# EAGLE schematic PCB-ACMb (EAGLE 6.4)
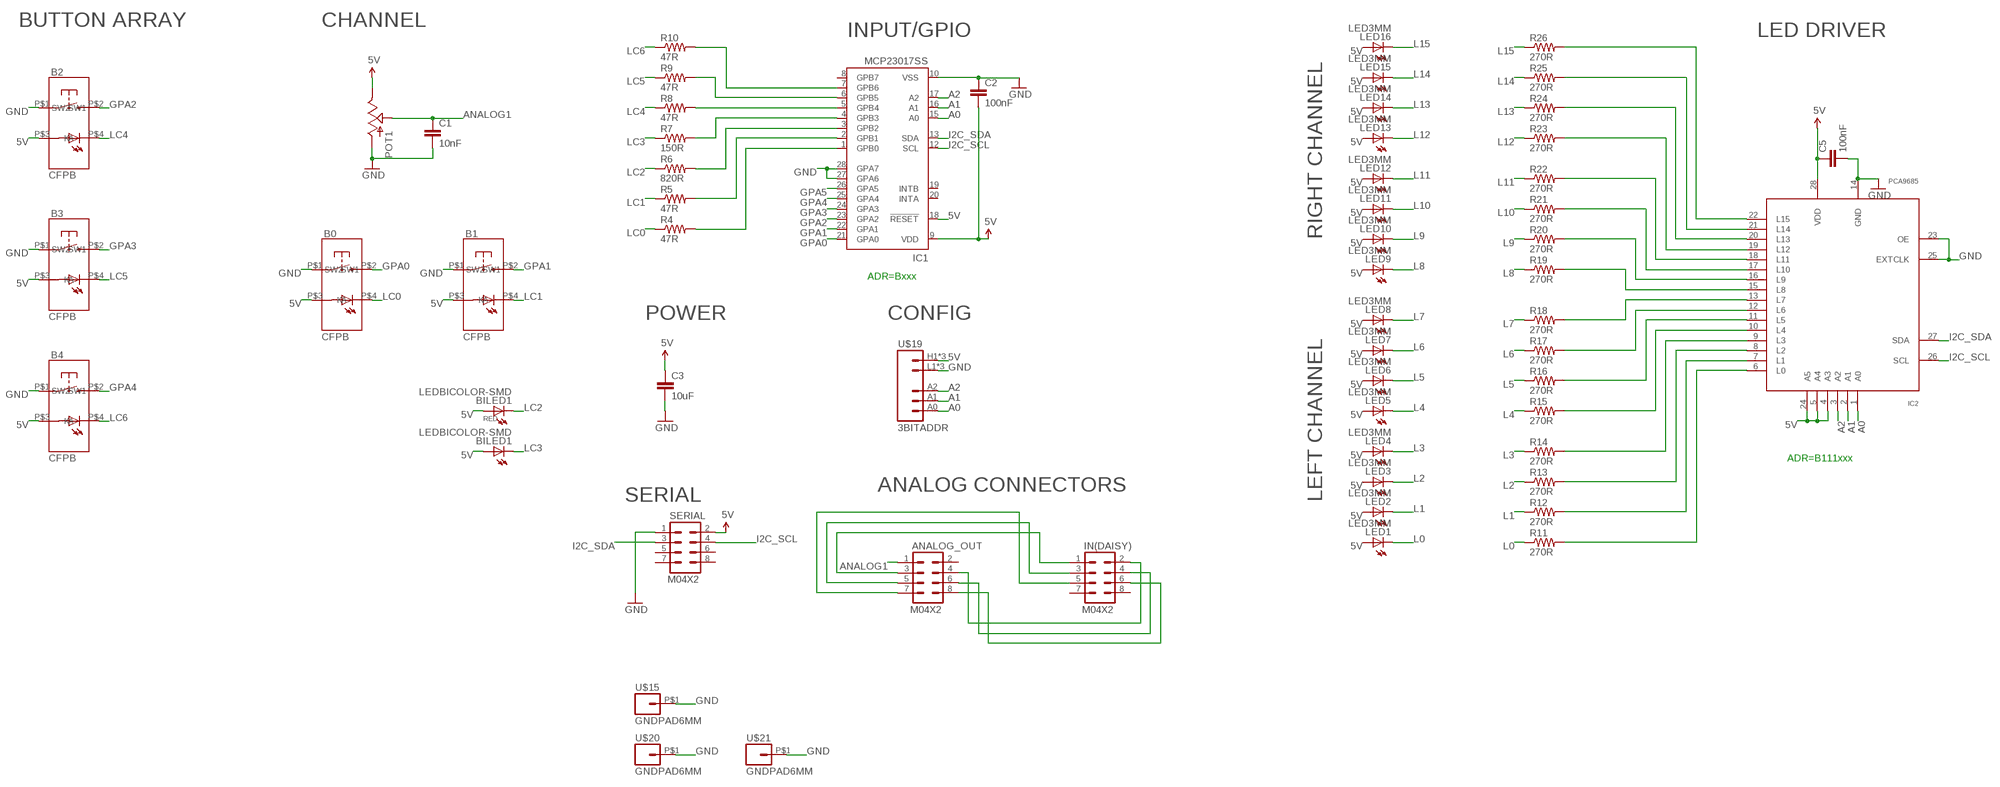
[diagram p0: schematic, sheet 1]

## Parts
ANALOG_OUT  M04X2  [2X4]
B0  CFPB  [CFPB-6/9MM]
B1  CFPB  [CFPB-6/9MM]
B2  CFPB  [CFPB-6/9MM]
B3  CFPB  [CFPB-6/9MM]
B4  CFPB  [CFPB-6/9MM]
BILED1  LEDBICOLOR-SMD  [LEDBICOLOR-SMD]
C1  10nF  CAP0603-CAP  [0603-CAP]
C2  100nF  CAP0603-CAP  [0603-CAP]
C3  10uF  CAP0805  [0805]
C5  100nF  CAP0603-CAP  [0603-CAP]
IC1  MCP23017SS  [SSOP28]
IC2  PCA9685  [TSSOP28]
IN(DAISY)  M04X2  [2X4]
LED1  LED3MM  [LED3MM]
LED2  LED3MM  [LED3MM]
LED3  LED3MM  [LED3MM]
LED4  LED3MM  [LED3MM]
LED5  LED3MM  [LED3MM]
LED6  LED3MM  [LED3MM]
LED7  LED3MM  [LED3MM]
LED8  LED3MM  [LED3MM]
LED9  LED3MM  [LED3MM]
LED10  LED3MM  [LED3MM]
LED11  LED3MM  [LED3MM]
LED12  LED3MM  [LED3MM]
LED13  LED3MM  [LED3MM]
LED14  LED3MM  [LED3MM]
LED15  LED3MM  [LED3MM]
LED16  LED3MM  [LED3MM]
POT1  POT  [ALPS_POT]
R4  47R  RESISTOR0603-RES  [0603-RES]
R5  47R  RESISTOR0603-RES  [0603-RES]
R6  820R  RESISTOR0603-RES  [0603-RES]
R7  150R  RESISTOR0603-RES  [0603-RES]
R8  47R  RESISTOR0603-RES  [0603-RES]
R9  47R  RESISTOR0603-RES  [0603-RES]
R10  47R  RESISTOR0603-RES  [0603-RES]
R11  270R  RESISTOR0603-RES  [0603-RES]
R12  270R  RESISTOR0603-RES  [0603-RES]
R13  270R  RESISTOR0603-RES  [0603-RES]
R14  270R  RESISTOR0603-RES  [0603-RES]
R15  270R  RESISTOR0603-RES  [0603-RES]
R16  270R  RESISTOR0603-RES  [0603-RES]
R17  270R  RESISTOR0603-RES  [0603-RES]
R18  270R  RESISTOR0603-RES  [0603-RES]
R19  270R  RESISTOR0603-RES  [0603-RES]
R20  270R  RESISTOR0603-RES  [0603-RES]
R21  270R  RESISTOR0603-RES  [0603-RES]
R22  270R  RESISTOR0603-RES  [0603-RES]
R23  270R  RESISTOR0603-RES  [0603-RES]
R24  270R  RESISTOR0603-RES  [0603-RES]
R25  270R  RESISTOR0603-RES  [0603-RES]
R26  270R  RESISTOR0603-RES  [0603-RES]
SERIAL  M04X2  [2X4]
U$15  GNDPAD6MM  [3.2MMPAD6MM]
U$19  3BITADDR  [3BITADDR]
U$20  GNDPAD6MM  [3.2MMPAD6MM]
U$21  GNDPAD6MM  [3.2MMPAD6MM]

## Nets
5V [Power]: B0.P$3(A) B1.P$3(A) B2.P$3(A) B3.P$3(A) B4.P$3(A) BILED1.P$1(A) BILED1.P$3(A1) C2.2 C3.1 C5.1 IC1.9(VDD) IC1.18(!RESET) IC2.4(A3) IC2.5(A4) IC2.24(A5) IC2.28(VDD) LED1.A LED2.A LED3.A LED4.A LED5.A LED6.A LED7.A LED8.A LED9.A LED10.A LED11.A LED12.A LED13.A LED14.A LED15.A LED16.A POT1.P$1(E) SERIAL.2 U$19.H1(VCC) U$19.H2(VCC) U$19.H3(VCC)
A0: IC1.15(A0) IC2.1(A0) U$19.A0
A1: IC1.16(A1) IC2.2(A1) U$19.A1
A2: IC1.17(A2) IC2.3(A2) U$19.A2
ANALOG1: ANALOG_OUT.1 C1.1 POT1.P$2(S)
GND [Power]: B0.P$1(SW1) B1.P$1(SW1) B2.P$1(SW1) B3.P$1(SW1) B4.P$1(SW1) C1.2 C2.1 C3.2 C5.2 IC1.10(VSS) IC1.27(GPA6) IC1.28(GPA7) IC2.14(GND) IC2.23(OE) IC2.25(EXTCLK) POT1.P$3(A) SERIAL.1 U$15.P$1 U$19.L1(GND) U$19.L2(GND) U$19.L3(GND) U$20.P$1 U$21.P$1
GPA0 [Signal]: B0.P$2(SW2) IC1.21(GPA0)
GPA1 [Signal]: B1.P$2(SW2) IC1.22(GPA1)
GPA2 [Signal]: B2.P$2(SW2) IC1.23(GPA2)
GPA3 [Signal]: B3.P$2(SW2) IC1.24(GPA3)
GPA4 [Signal]: B4.P$2(SW2) IC1.25(GPA4)
GPA5 [Signal]: IC1.26(GPA5)
I2C_SCL: IC1.12(SCL) IC2.26(SCL) SERIAL.4
I2C_SDA: IC1.13(SDA) IC2.27(SDA) SERIAL.3
L0: LED1.K(C) R11.1
L1: LED2.K(C) R12.1
L2: LED3.K(C) R13.1
L3: LED4.K(C) R14.1
L4: LED5.K(C) R15.1
L5: LED6.K(C) R16.1
L6: LED7.K(C) R17.1
L7: LED8.K(C) R18.1
L8: LED9.K(C) R19.1
L9: LED10.K(C) R20.1
L10: LED11.K(C) R21.1
L11: LED12.K(C) R22.1
L12: LED13.K(C) R23.1
L13: LED14.K(C) R24.1
L14: LED15.K(C) R25.1
L15: LED16.K(C) R26.1
LC0: B0.P$4(K) R4.1
LC1: B1.P$4(K) R5.1
LC2: BILED1.P$2(C) R6.1
LC3: BILED1.P$4(C1) R7.1
LC4: B2.P$4(K) R8.1
LC5: B3.P$4(K) R9.1
LC6: B4.P$4(K) R10.1
N$1: IC2.13(L7) R18.2
N$2: IC1.4(GPB3) R7.2
N$3: IC1.5(GPB4) R8.2
N$4: IC1.6(GPB5) R9.2
N$5: IC1.7(GPB6) R10.2
N$7: IC1.3(GPB2) R6.2
N$8: IC1.2(GPB1) R5.2
N$9: IC1.1(GPB0) R4.2
N$10: ANALOG_OUT.3 IN(DAISY).1
N$11: ANALOG_OUT.5 IN(DAISY).3
N$12: ANALOG_OUT.7 IN(DAISY).5
N$13: ANALOG_OUT.4 IN(DAISY).2
N$14: ANALOG_OUT.6 IN(DAISY).4
N$15: ANALOG_OUT.8 IN(DAISY).6
N$16: IC2.12(L6) R17.2
N$17: IC2.11(L5) R16.2
N$18: IC2.10(L4) R15.2
N$19: IC2.9(L3) R14.2
N$20: IC2.8(L2) R13.2
N$21: IC2.7(L1) R12.2
N$22: IC2.6(L0) R11.2
N$23: IC2.15(L8) R19.2
N$24: IC2.16(L9) R20.2
N$25: IC2.17(L10) R21.2
N$26: IC2.18(L11) R22.2
N$27: IC2.19(L12) R23.2
N$28: IC2.20(L13) R24.2
N$29: IC2.21(L14) R25.2
N$30: IC2.22(L15) R26.2
Unconnected: ANALOG_OUT.2 IC1.8(GPB7) IC1.19(INTB) IC1.20(INTA) IN(DAISY).7 IN(DAISY).8 SERIAL.5 SERIAL.6 SERIAL.7 SERIAL.8

## Notes on the sheet
- BUTTON ARRAY | CHANNEL
- INPUT/GPIO | LED DRIVER
- RIGHT CHANNEL
- ADR=Bxxx
- POWER | CONFIG
- ADR=B111xxx
- ANALOG CONNECTORS
- SERIAL | LEFT CHANNEL

## Library data of the parts
ANALOG_OUT IN(DAISY) SERIAL = SparkFun:M04X2
B0 B1-B4 = SKAARHOJ:CFPB
BILED1 = SKAARHOJ:LEDBICOLOR-SMD
C1-C3 C5 = SparkFun:CAP: Capacitor Standard 0603 ceramic capacitor, and 0.1" leaded capacitor.
IC1 = microchip:MCP23017: http://ww1.microchip.com/downloads/en/DeviceDoc/21952a.pdf Source: http://ww1.microchip.com/downloads/en/DeviceDoc/21952a.pdf; MF: MICROCHIP; MPN: MCP23017-E/SS; OC_FARNELL: 1467674; OC_NEWARK: 31K2960
IC2 = wsmith:PCA9685
LED1-LED16 = SKAARHOJ:LED: KINGBRIGHT 20MM BIG LAMP
POT1 = SparkFun:POT
R4-R26 = SparkFun:RESISTOR: Resistor Basic schematic elements and footprints for 0603, 1206, and PTH resistors.
U$15 U$20 U$21 = SKAARHOJ:GNDPAD
U$19 = SKAARHOJ:3BITADDR

## Net classes
0 default: width 0.203 mm, drill 0.406 mm, clearance 0.152 mm
1 Power: width 0.406 mm, drill 0.61 mm, clearance 0.203 mm
2 Signal: width 0.152 mm, clearance 0.152 mm